# EAGLE design Scanit (EAGLE 7.2.0)

## Sheet 1 of 4
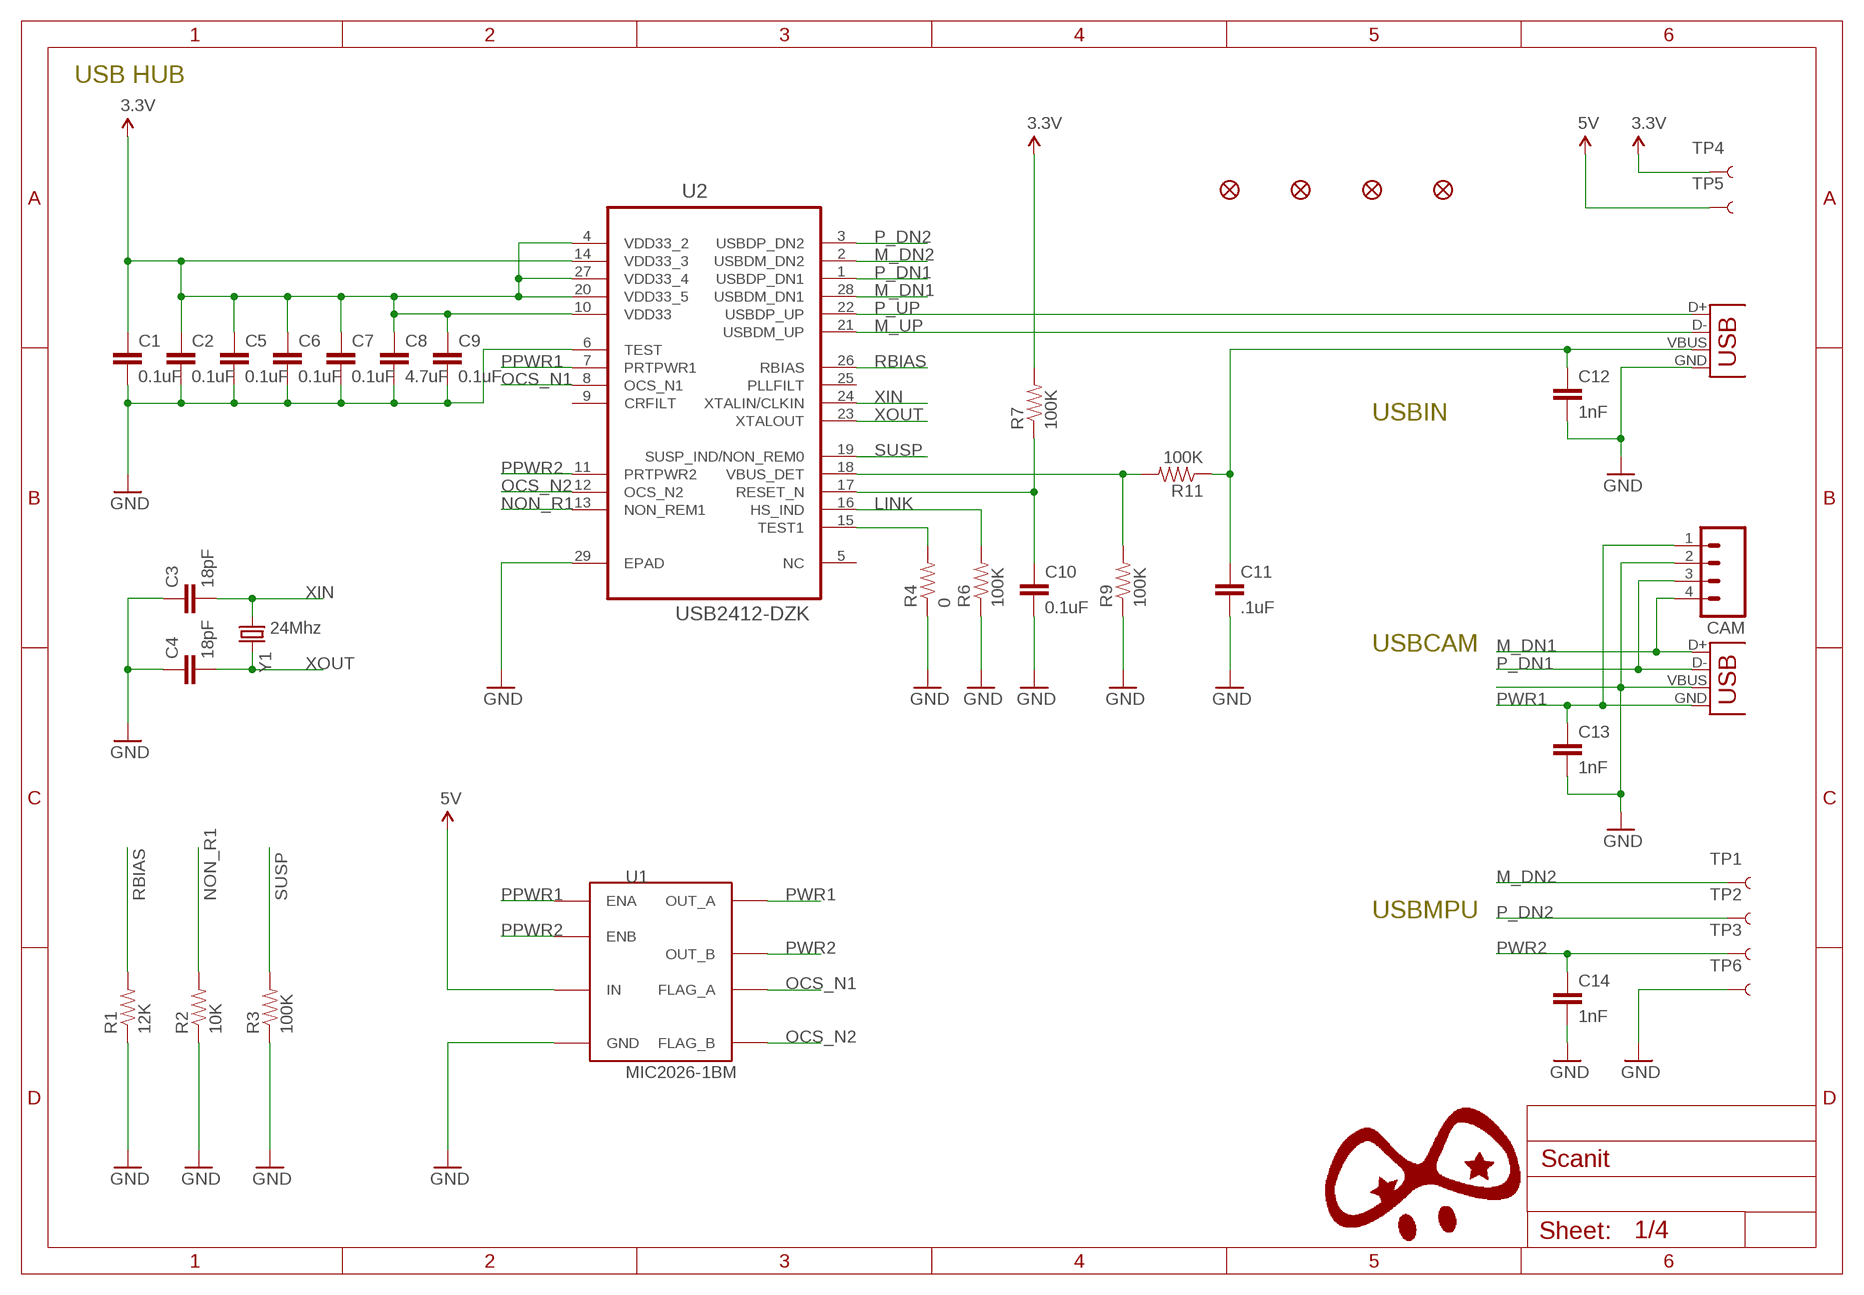
[diagram p0: schematic, sheet 1]

### Parts
C1  0.1uF  CAP0603-CAP  [0603-CAP]
C2  0.1uF  CAP0603-CAP  [0603-CAP]
C3  18pF  CAP0603-CAP  [0603-CAP]
C4  18pF  CAP0603-CAP  [0603-CAP]
C5  0.1uF  CAP0603-CAP  [0603-CAP]
C6  0.1uF  CAP0603-CAP  [0603-CAP]
C7  0.1uF  CAP0603-CAP  [0603-CAP]
C8  4.7uF  CAP0603-CAP  [0603-CAP]
C9  0.1uF  CAP0603-CAP  [0603-CAP]
C10  0.1uF  CAP0603-CAP  [0603-CAP]
C11  .1uF  CAP0603-CAP  [0603-CAP]
C12  1nF  CAP0603-CAP  [0603-CAP]
C13  1nF  CAP0603-CAP  [0603-CAP]
C14  1nF  CAP0603-CAP  [0603-CAP]
CAM  M04JST-PTH-VERT  [JST-4-PTH-VERT]
FID1  FIDUCIAL1X2  [FIDUCIAL-1X2]
FID2  FIDUCIAL1X2  [FIDUCIAL-1X2]
FID3  FIDUCIAL1X2  [FIDUCIAL-1X2]
FID4  FIDUCIAL1X2  [FIDUCIAL-1X2]
R1  12K  RESISTOR0603  [0603-RES]
R2  10K  RESISTOR0603  [0603-RES]
R3  100K  RESISTOR0603  [0603-RES]
R4  0  RESISTOR0603  [0603-RES]
R6  100K  RESISTOR0603  [0603-RES]
R7  100K  RESISTOR0603  [0603-RES]
R9  100K  RESISTOR0603  [0603-RES]
R11  100K  RESISTOR0603  [0603-RES]
TP1  TEST-POINT3X5  [PAD.03X.05]
TP2  TEST-POINT3X5  [PAD.03X.05]
TP3  TEST-POINT3X5  [PAD.03X.05]
TP4  TEST-POINT3X5  [PAD.03X.05]
TP5  TEST-POINT3X5  [PAD.03X.05]
TP6  TEST-POINT3X5  [PAD.03X.05]
U1  MIC2026-1BM  MIC2026  [SOP-8]
U2  USB2412-DZK  [QFN50P500X500X100-29N]
USB  USBPTH-VERTICAL  [USB-B-PTH-VERTICAL]
USBCAM  USB-A-S  [USB-A-S]
Y1  24Mhz  CRYSTAL5X3  [CRYSTAL-SMD-5X3]

### Nets
3.3V: C1.1 C2.1 C5.1 C6.1 C7.1 C8.1 C9.1 R7.2 TP4.P$1 U2.4(VDD33_2) U2.10(VDD33) U2.14(VDD33_3) U2.20(VDD33_5) U2.27(VDD33_4) ; also sheet 2,3,4
5V: TP5.P$1 U1.7(IN) ; also sheet 2,4
GND: C1.2 C2.2 C3.1 C4.1 C5.2 C6.2 C7.2 C8.2 C9.2 C10.2 C11.2 C12.2 C13.2 C14.2 CAM.2 R1.1 R2.1 R3.1 R4.1 R6.1 R9.1 TP6.P$1 U1.6(GND) U2.6(TEST) U2.29(EPAD) USB.GND USBCAM.VBUS ; also sheet 2,3,4
LINK: R6.2 U2.16(HS_IND)
M_DN1: CAM.4 U2.28(USBDM_DN1) USBCAM.D+
M_DN2: TP1.P$1 U2.2(USBDM_DN2) ; also sheet 2
M_UP: U2.21(USBDM_UP) USB.D-
N$1: R4.2 U2.15(TEST1)
N$2: C10.1 R7.1 U2.17(RESET_N)
N$7: R9.2 R11.2 U2.18(VBUS_DET)
N$8: C11.1 C12.1 R11.1 USB.VBUS
NON_R1: R2.2 U2.13(NON_REM1)
OCS_N1: U1.2(FLAG_A) U2.8(OCS_N1)
OCS_N2: U1.3(FLAG_B) U2.12(OCS_N2)
P_DN1: CAM.3 U2.1(USBDP_DN1) USBCAM.D-
P_DN2: TP2.P$1 U2.3(USBDP_DN2) ; also sheet 2
P_UP: U2.22(USBDP_UP) USB.D+
PPWR1: U1.1(ENA) U2.7(PRTPWR1)
PPWR2: U1.4(ENB) U2.11(PRTPWR2)
PWR1: C13.1 CAM.1 U1.8(OUT_A) USBCAM.GND
PWR2: C14.1 TP3.P$1 U1.5(OUT_B) ; also sheet 2
RBIAS: R1.2 U2.26(RBIAS)
SUSP: R3.2 U2.19(SUSP_IND/NON_REM0)
XIN: C3.2 U2.24(XTALIN/CLKIN) Y1.1
XOUT: C4.2 U2.23(XTALOUT) Y1.3
Unconnected: U2.5(NC) U2.9(CRFILT) U2.25(PLLFILT)

### Notes on the sheet
- USB HUB
- USBIN
- USBCAM
- USBMPU

## Sheet 2 of 4
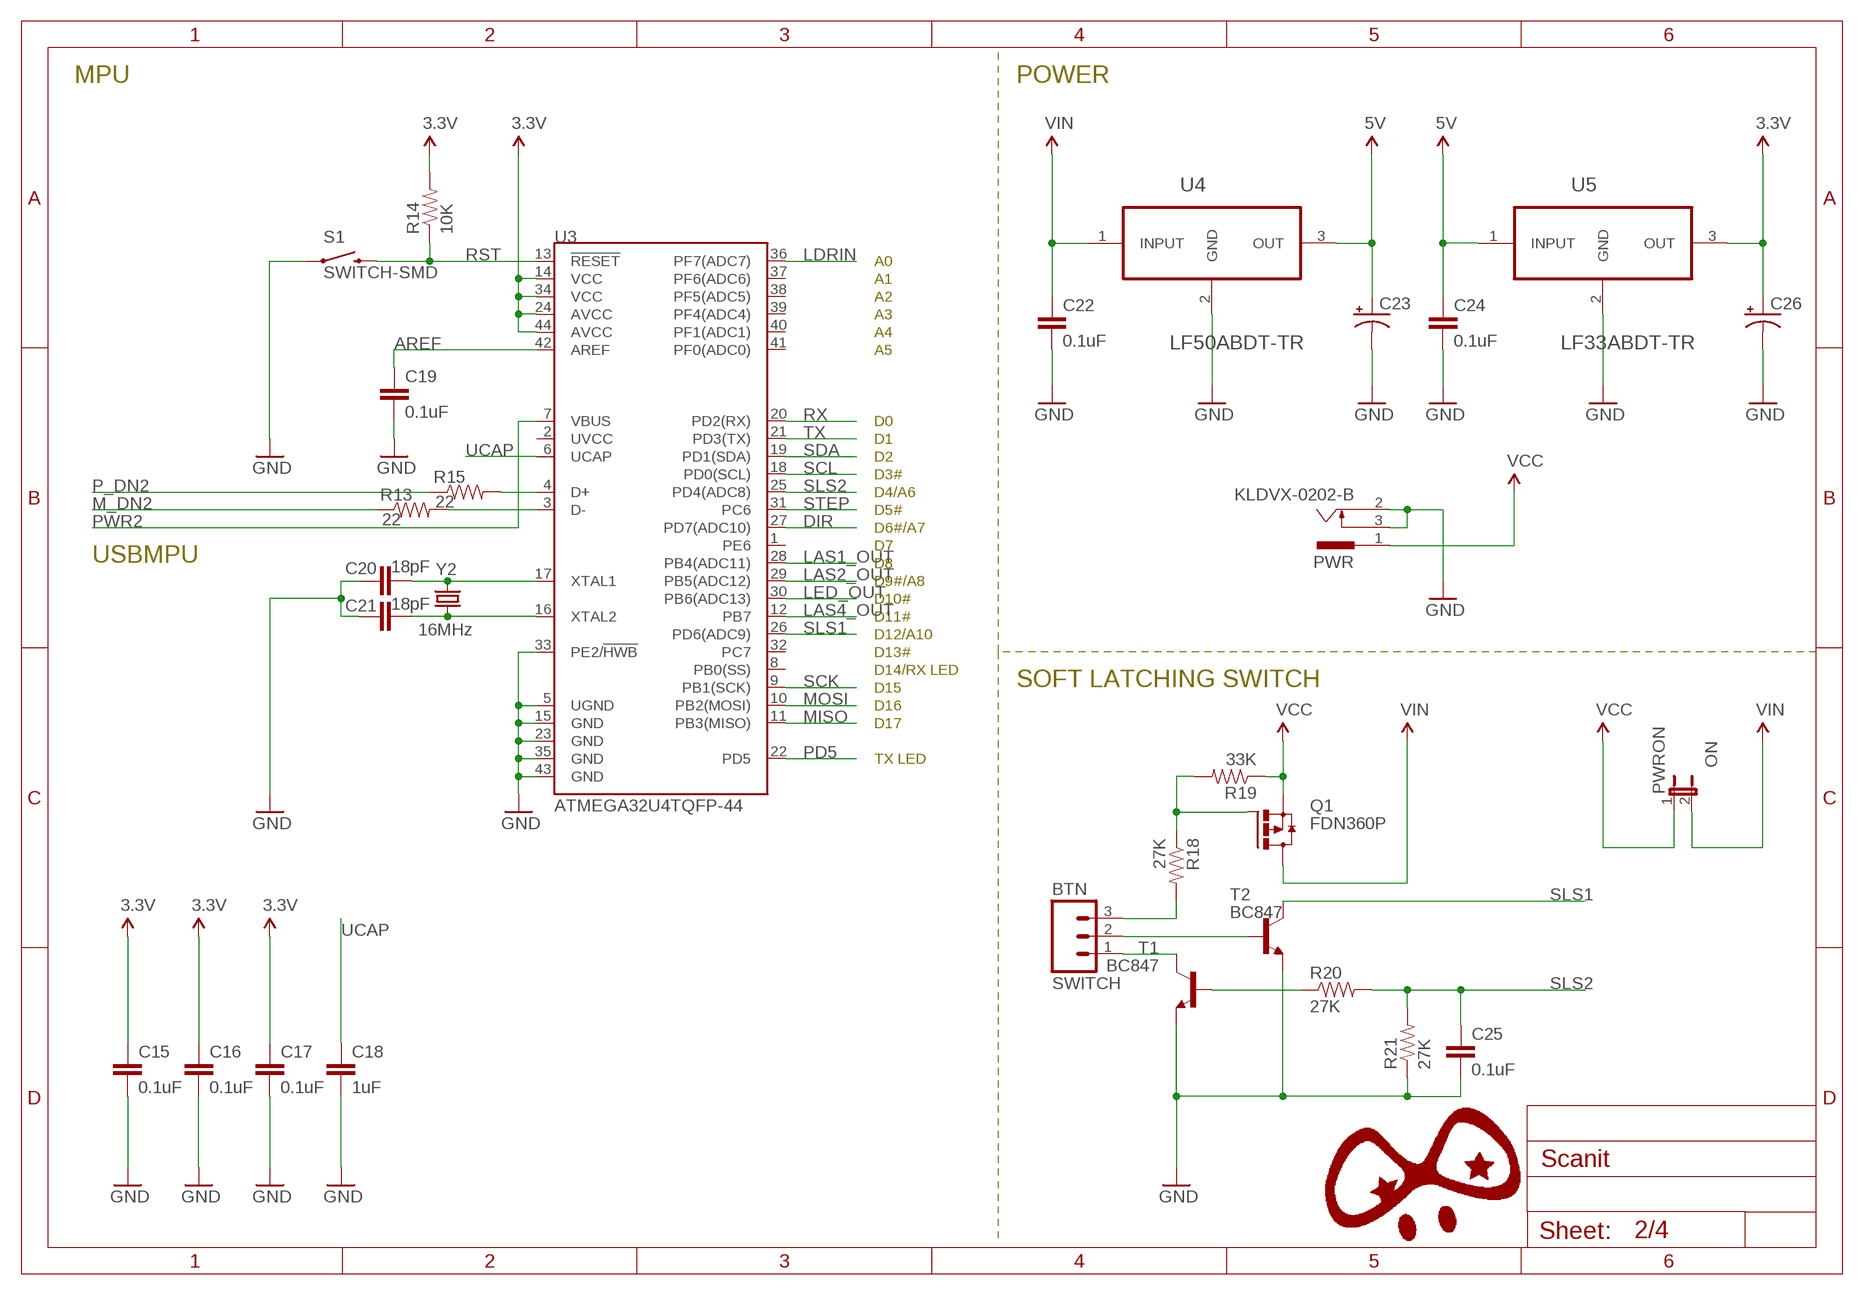
[diagram p1: schematic, sheet 2]

### Parts
BTN  SWITCH  M03JST-PTH-VERT  [JST-3-PTH-VERT]
C15  0.1uF  CAP0603-CAP  [0603-CAP]
C16  0.1uF  CAP0603-CAP  [0603-CAP]
C17  0.1uF  CAP0603-CAP  [0603-CAP]
C18  1uF  CAP0603-CAP  [0603-CAP]
C19  0.1uF  CAP0603-CAP  [0603-CAP]
C20  18pF  CAP0603-CAP  [0603-CAP]
C21  18pF  CAP0603-CAP  [0603-CAP]
C22  0.1uF  CAP1210  [1210]
C23  CAP_POLD  [PANASONIC_D]
C24  0.1uF  CAP1210  [1210]
C25  0.1uF  CAP0603-CAP  [0603-CAP]
C26  CAP_POLD  [PANASONIC_D]
PWR  KLDVX-0202-B  [KLDVX-0202-B]
PWRON  ON  JUMPER-2PTH  [1X02]
Q1  FDN360P  [SUPER-SOT3]
R13  22  RESISTOR0402-RES  [0402-RES]
R14  10K  RESISTOR0603-RES  [0603-RES]
R15  22  RESISTOR0402-RES  [0402-RES]
R18  27K  RESISTOR0603-RES  [0603-RES]
R19  33K  RESISTOR0603-RES  [0603-RES]
R20  27K  RESISTOR0603-RES  [0603-RES]
R21  27K  RESISTOR0603-RES  [0603-RES]
S1  SWITCH-SMD  SWITCH-MOMENTARY-2SMD  [TACTILE_SWITCH_SMD]
T1  BC847  [SOT23]
T2  BC847  [SOT23]
U3  ATMEGA32U4TQFP-44  [TQFP44]
U4  LF50ABDT-TR  LF33ABDT-TR  [TO228P972X240-3N]
U5  LF33ABDT-TR  [TO228P972X240-3N]
Y2  16MHz  CRYSTAL5X3  [CRYSTAL-SMD-5X3]

### Nets
3.3V: C15.1 C16.1 C17.1 C26.+ R14.2 U3.14(VCC) U3.24(AVCC) U3.34(VCC) U3.44(AVCC) U5.3(OUT) ; also sheet 1,3,4
5V: C23.+ C24.1 U4.3(OUT) U5.1(INPUT) ; also sheet 1,4
AREF: C19.1 U3.42(AREF)
DIR: U3.27(PD7(ADC10)) ; also sheet 3
GND: C15.2 C16.2 C17.2 C18.2 C19.2 C20.1 C21.1 C22.2 C23.- C24.2 C25.2 C26.- PWR.2 PWR.3 R21.1 S1.1 T1.2(E) T2.2(E) U3.5(UGND) U3.15(GND) U3.23(GND) U3.33(PE2/!HWB) U3.35(GND) U3.43(GND) U4.2(GND) U5.2(GND) ; also sheet 1,3,4
LAS1_OUT: U3.28(PB4(ADC11)) ; also sheet 4
LAS2_OUT: U3.29(PB5(ADC12)) ; also sheet 4
LAS4_OUT: U3.12(PB7)
LDRIN: U3.36(PF7(ADC7)) ; also sheet 3
LED_OUT: U3.30(PB6(ADC13)) ; also sheet 3
M_DN2: R13.1 ; also sheet 1
MISO: U3.11(PB3(MISO)) ; also sheet 4
MOSI: U3.10(PB2(MOSI)) ; also sheet 4
N$9: C20.2 U3.17(XTAL1) Y2.3
N$10: C21.2 U3.16(XTAL2) Y2.1
N$11: R15.2 U3.4(D+)
N$12: R13.2 U3.3(D-)
N$13: BTN.1 T1.3(C)
N$42: Q1.1(G) R18.1 R19.2
N$43: BTN.3 R18.2
N$45: BTN.2 T2.1(B)
N$46: R20.1 T1.1(B)
P_DN2: R15.1 ; also sheet 1
PD5: U3.22(PD5)
PWR2: U3.7(VBUS) ; also sheet 1
RST: R14.1 S1.3 U3.13(!RESET) ; also sheet 4
RX: U3.20(PD2(RX))
SCK: U3.9(PB1(SCK)) ; also sheet 4
SCL: U3.18(PD0(SCL))
SDA: U3.19(PD1(SDA))
SLS1: T2.3(C) U3.26(PD6(ADC9))
SLS2: C25.1 R20.2 R21.2 U3.25(PD4(ADC8))
STEP: U3.31(PC6) ; also sheet 3
TX: U3.21(PD3(TX))
UCAP: C18.1 U3.6(UCAP)
VCC: PWR.1 PWRON.1 Q1.2(S) R19.1
VIN: C22.1 PWRON.2 Q1.3(D) U4.1(INPUT) ; also sheet 3
Unconnected: PWR.1@1 PWR.2@1 PWR.3@1 U3.1(PE6) U3.2(UVCC) U3.8(PB0(SS)) U3.32(PC7) U3.37(PF6(ADC6)) U3.38(PF5(ADC5)) U3.39(PF4(ADC4)) U3.40(PF1(ADC1)) U3.41(PF0(ADC0))

### Notes on the sheet
- MPU | POWER
- USBMPU
- SOFT LATCHING SWITCH

## Sheet 3 of 4
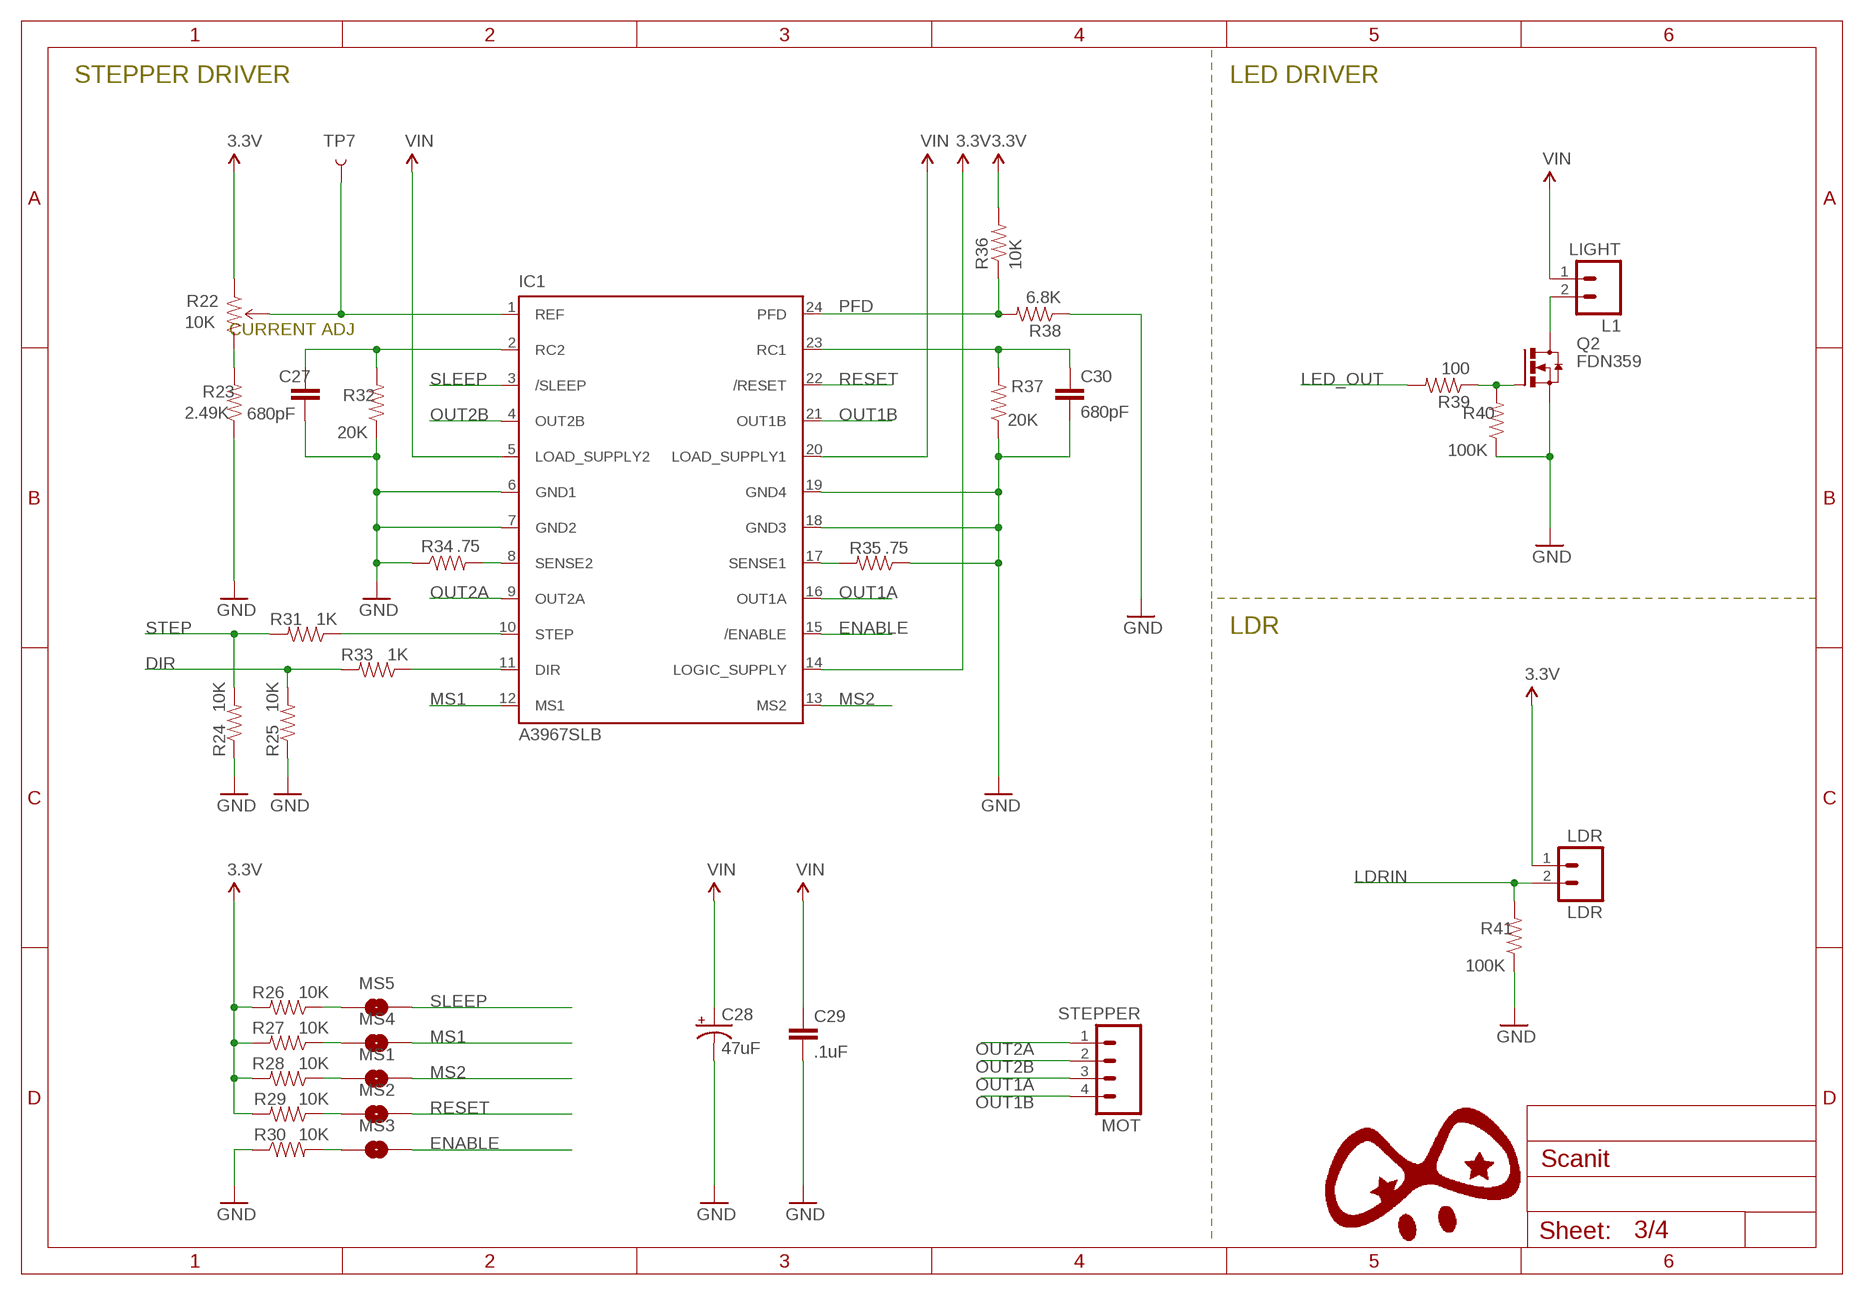
[diagram p2: schematic, sheet 3]

### Parts
C27  680pF  CAP0603-CAP  [0603-CAP]
C28  47uF  CPOL-USD  [PANASONIC_D]
C29  .1uF  CAP0603-CAP  [0603-CAP]
C30  680pF  CAP0603-CAP  [0603-CAP]
IC1  A3967SLB  [SO24W]
L1  LIGHT  M02JST-PTH-VERT  [JST-2-PTH-VERT]
LDR  LDR  M02JST-PTH-VERT  [JST-2-PTH-VERT]
MOT  STEPPER  M04JST-PTH-VERT  [JST-4-PTH-VERT]
MS1  SOLDERJUMPERTRACE  [SJ_2S-TRACE]
MS2  SOLDERJUMPERTRACE  [SJ_2S-TRACE]
MS3  SOLDERJUMPERTRACE  [SJ_2S-TRACE]
MS4  SOLDERJUMPERTRACE  [SJ_2S-TRACE]
MS5  SOLDERJUMPERTRACE  [SJ_2S-TRACE]
Q2  FDN359  [SUPER-SOT3]
R22  10K  TRIMPOT3MM-2  [TRIMPOT-3MM-2]
R23  2.49K  RESISTOR0603  [0603-RES]
R24  10K  RESISTOR0603  [0603-RES]
R25  10K  RESISTOR0603  [0603-RES]
R26  10K  RESISTOR0603  [0603-RES]
R27  10K  RESISTOR0603  [0603-RES]
R28  10K  RESISTOR0603  [0603-RES]
R29  10K  RESISTOR0603  [0603-RES]
R30  10K  RESISTOR0603  [0603-RES]
R31  1K  RESISTOR0603  [0603-RES]
R32  20K  RESISTOR0603  [0603-RES]
R33  1K  RESISTOR0603  [0603-RES]
R34  .75  RESISTOR0805-RES  [0805]
R35  .75  RESISTOR0805-RES  [0805]
R36  10K  RESISTOR0603  [0603-RES]
R37  20K  RESISTOR0603  [0603-RES]
R38  6.8K  RESISTOR0603  [0603-RES]
R39  100  RESISTOR0603  [0603-RES]
R40  100K  RESISTOR0603  [0603-RES]
R41  100K  RESISTOR0603  [0603-RES]
TP7  TEST-POINTTP_15TH_THRU  [TP_15TH]

### Nets
3.3V: IC1.14(LOGIC_SUPPLY) LDR.1 R22.1(CCW) R26.2 R27.2 R28.2 R29.2 R36.2 ; also sheet 1,2,4
DIR: R25.2 R33.2 ; also sheet 2
ENABLE: IC1.15(/ENABLE) MS3.2
GND: C27.2 C28.- C29.2 C30.2 IC1.6(GND1) IC1.7(GND2) IC1.18(GND3) IC1.19(GND4) Q2.2(S) R23.1 R24.1 R25.1 R30.1 R32.1 R34.1 R35.1 R37.1 R38.1 R40.1 R41.1 ; also sheet 1,2,4
LDRIN: LDR.2 R41.2 ; also sheet 2
LED_OUT: R39.2 ; also sheet 2
MS1: IC1.12(MS1) MS4.2
MS2: IC1.13(MS2) MS1.2
N$14: IC1.8(SENSE2) R34.2
N$15: IC1.17(SENSE1) R35.2
N$16: C27.1 IC1.2(RC2) R32.2
N$17: C30.1 IC1.23(RC1) R37.2
N$18: R22.3(CW) R23.2
N$19: IC1.10(STEP) R31.1
N$20: IC1.11(DIR) R33.1
N$21: MS5.1 R26.1
N$23: MS4.1 R27.1
N$24: MS1.1 R28.1
N$25: MS2.1 R29.1
N$26: MS3.1 R30.2
N$27: Q2.1(G) R39.1 R40.2
N$28: L1.2 Q2.3(D)
N$33: L1.1
OUT1A: IC1.16(OUT1A) MOT.3
OUT1B: IC1.21(OUT1B) MOT.4
OUT2A: IC1.9(OUT2A) MOT.1
OUT2B: IC1.4(OUT2B) MOT.2
PFD: IC1.24(PFD) R36.1 R38.2
RESET: IC1.22(/RESET) MS2.2
SLEEP: IC1.3(/SLEEP) MS5.2
STEP: R24.2 R31.2 ; also sheet 2
VIN: C28.+ C29.1 IC1.5(LOAD_SUPPLY2) IC1.20(LOAD_SUPPLY1) ; also sheet 2
VREF: IC1.1(REF) R22.2(WIPER) TP7.P$1

### Notes on the sheet
- STEPPER DRIVER | LED DRIVER
- CURRENT ADJ
- LDR

## Sheet 4 of 4
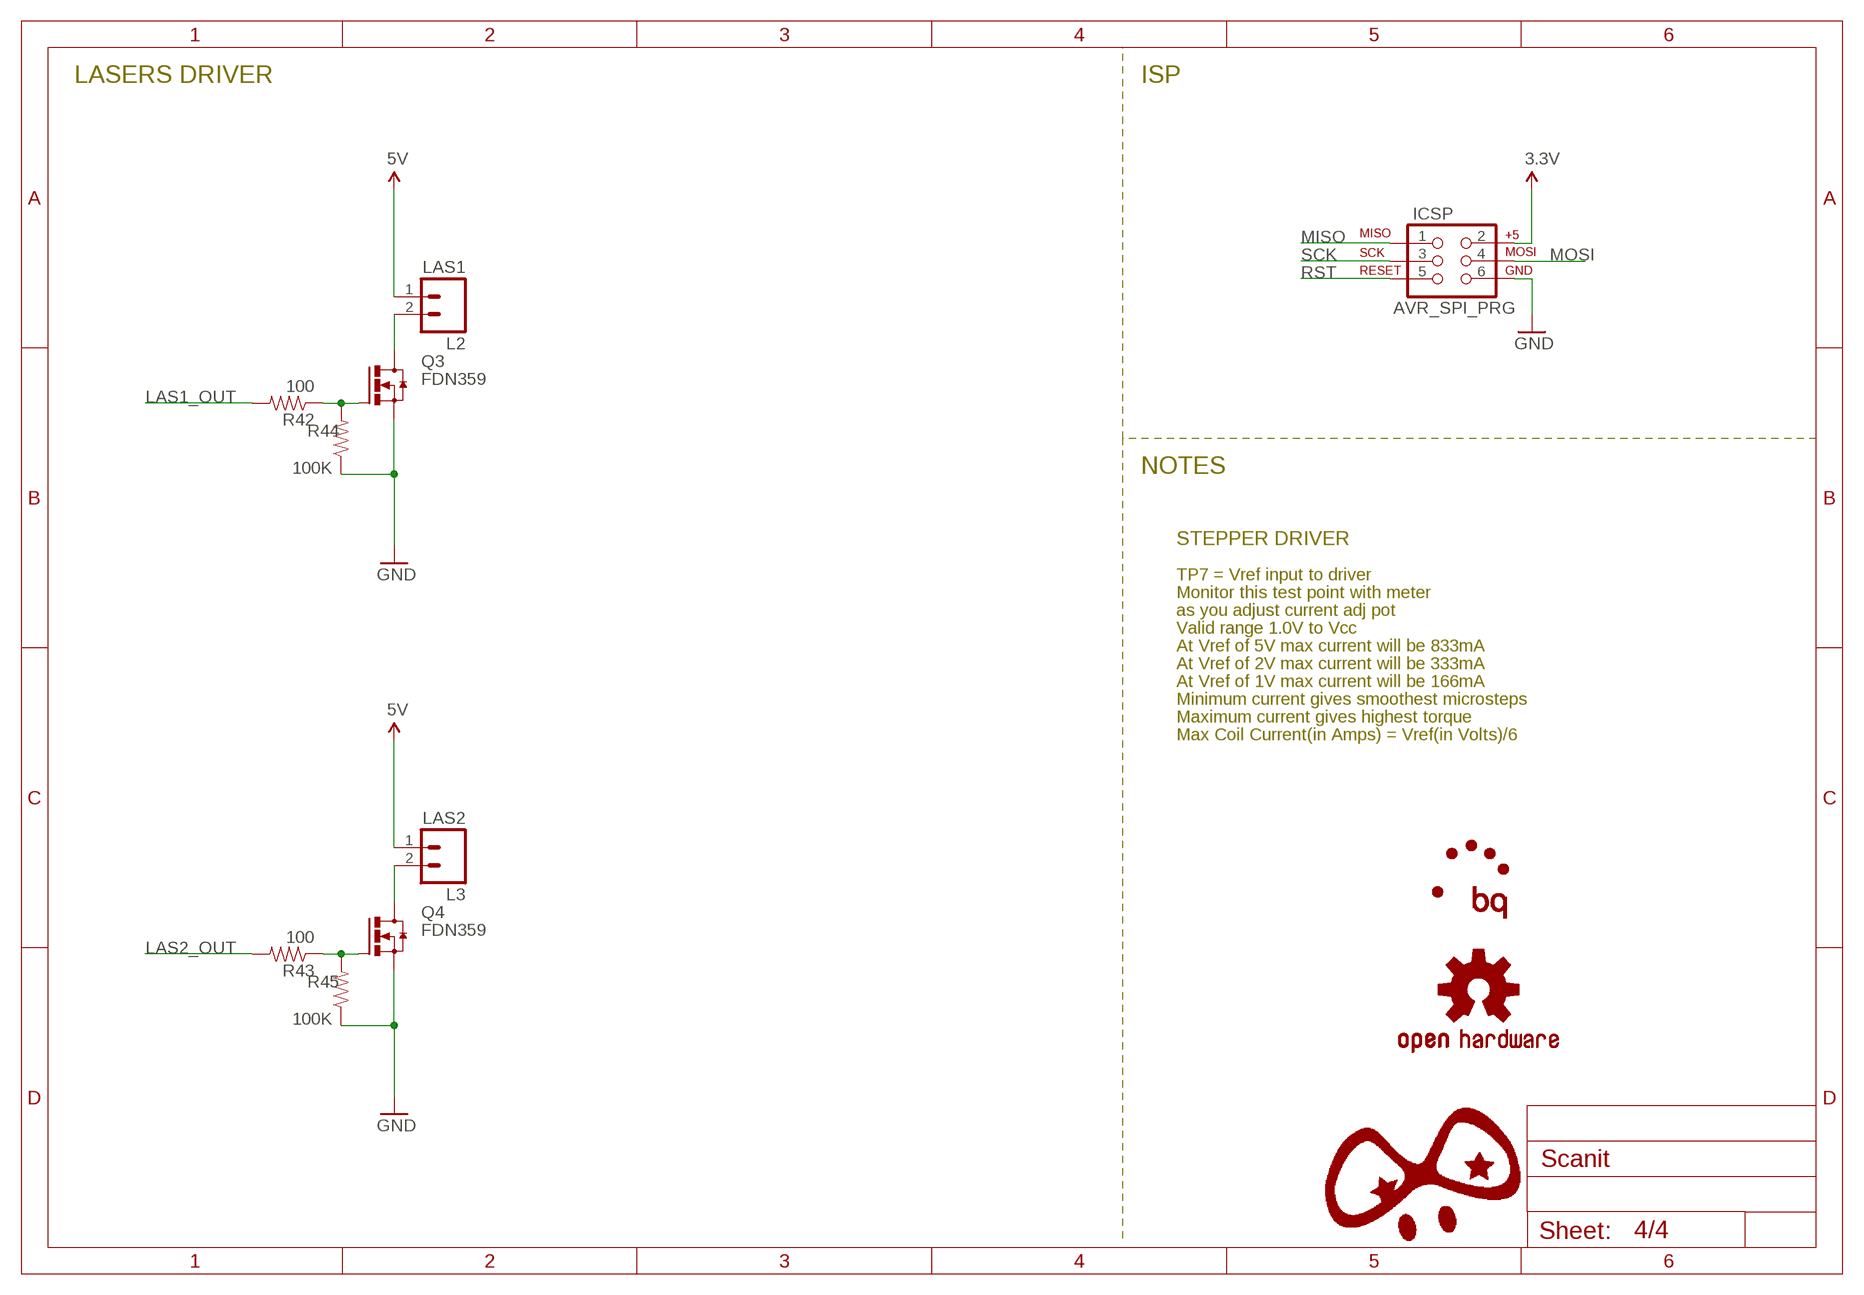
[diagram p3: schematic, sheet 4]

### Parts
ICSP  AVR_SPI_PRG  AVR_SPI_PRG_6PTH  [2X3]
L2  LAS1  M02JST-PTH-VERT  [JST-2-PTH-VERT]
L3  LAS2  M02JST-PTH-VERT  [JST-2-PTH-VERT]
LOGO2  OSHW-LOGOM  [OSHW-LOGO-M]
Q3  FDN359  [SUPER-SOT3]
Q4  FDN359  [SUPER-SOT3]
R42  100  RESISTOR0603  [0603-RES]
R43  100  RESISTOR0603  [0603-RES]
R44  100K  RESISTOR0603  [0603-RES]
R45  100K  RESISTOR0603  [0603-RES]

### Nets
3.3V: ICSP.2 ; also sheet 1,2,3
5V: L2.1 L3.1 ; also sheet 1,2
GND: ICSP.6 Q3.2(S) Q4.2(S) R44.1 R45.1 ; also sheet 1,2,3
LAS1_OUT: R42.2 ; also sheet 2
LAS2_OUT: R43.2 ; also sheet 2
MISO: ICSP.1 ; also sheet 2
MOSI: ICSP.4 ; also sheet 2
N$29: Q3.1(G) R42.1 R44.2
N$30: L2.2 Q3.3(D)
N$31: Q4.1(G) R43.1 R45.2
N$32: L3.2 Q4.3(D)
RST: ICSP.5 ; also sheet 2
SCK: ICSP.3 ; also sheet 2

### Notes on the sheet
- LASERS DRIVER | ISP
- NOTES
- STEPPER DRIVER
- TP7 = Vref input to driver
- Monitor this test point with meter
- as you adjust current adj pot
- Valid range 1.0V to Vcc
- At Vref of 5V max current will be 833mA
- At Vref of 2V max current will be 333mA
- At Vref of 1V max current will be 166mA
- Minimum current gives smoothest microsteps
- Maximum current gives highest torque
- Max Coil Current(in Amps) = Vref(in Volts)/6

## Library data of the parts
BTN = SparkFun-Connectors:M03: Header 3 Standard 3-pin 0.1" header. Use with straight break away headers (SKU : PRT-00116), right angle break away headers (PRT-00553), swiss pins (PRT-00743), machine pins (PRT-00117), and female headers (PRT-00115). Molex polarized connector foot print use with SKU : PRT-08232 with associated crimp pins and housings.
C1-C14 C22 C24 C27 C29 C30 = SparkFun-Capacitors:CAP: Capacitor Standard 0603 ceramic capacitor, and 0.1" leaded capacitor.
C15-C21 C25 = SparkFun:CAP: Capacitor Standard 0603 ceramic capacitor, and 0.1" leaded capacitor.
C23 C26 = SparkFun-Capacitors:CAP_POL: Capacitor Polarized These are standard SMD and PTH capacitors. Normally 10uF, 47uF, and 100uF in electrolytic and tantalum varieties. Always verify the external diameter of the through hole cap, it varies with capacity, voltage, and manufacturer. The EIA devices should be standard.
C28 = rcl:CPOL-US: POLARIZED CAPACITOR, American symbol
CAM MOT = SparkFun-Connectors:M04: Header 4 Standard 4-pin 0.1" header. Use with straight break away headers (SKU : PRT-00116), right angle break away headers (PRT-00553), swiss pins (PRT-00743), machine pins (PRT-00117), and female headers (PRT-00115). Molex polarized connector foot print use with SKU : PRT-08231 with associated crimp pins and housings. 1MM SMD Version SKU: PRT-10208
FID1-FID4 = SparkFun-Aesthetics:FIDUCIAL: Fiducial Alignment Points Various fiducial points for machine vision alignment.
IC1 = Allegro:A3967SLB: ANALOG DEVICES
ICSP = SparkFun:AVR_SPI_PRG_6: AVR ISP 6 Pin This is the reduced ISP connector for AVR programming. Common on Arduino. This footprint will take up less PCB space and can be used with a 10-pin to 6-pin adapter such as SKU: BOB-08508
L1-L3 LDR = SparkFun-Connectors:M02: Standard 2-pin 0.1" header. Use with - straight break away headers ( PRT-00116) - right angle break away headers (PRT-00553) - swiss pins (PRT-00743) - machine pins (PRT-00117) - female headers (PRT-00115) Molex polarized connector foot print use with: PRT-08233 with associated crimp pins and housings. 2.54_SCREWTERM for use with PRT-10571. 3.5mm Screw Terminal footprints for PRT-08084 5mm Screw Terminal footprints for use with PRT-08432
LOGO2 = SparkFun-Aesthetics:OSHW-LOGO: Open Source Hardware Logo This logo indicates the piece of hardware it is found on incorporates a OSHW license and/or adheres to the definition of open source hardware found here: http://freedomdefined.org/OSHW
MS1-MS5 = SparkFun-Retired:SOLDERJUMPER: Solder Jumper Standard SMD solder jumper. Used to automate production. Two varients : Normally Open and Normally Closed are the same, but have different paste layers. NC will have a large amount of paste and should jumper during reflow.
PWR = con-kycon:KLDVX-0202-: Power Jack, Vertical, PCB Mount, 2.0 mm, 2.5 mm, 3.0 mm Center Pin Source: KLDVX-0202x.pdf; OC_FARNELL: unknown; OC_NEWARK: unknown
PWRON = SparkFun-Retired:JUMPER-2: Jumper Basic 0.1" spaced jumper. Use with breakaway headers.
Q1 = transistor-power:FDN360P: Single P-Channel, PowerTrench (R) MOSFET Source: http://www.fairchildsemi.com/ds/FD/FDN360P.pdf
Q2-Q4 = transistor-power:FDN359
R1-R4 R6 R7 R9 R11 R23-R45 = SparkFun-Resistors:RESISTOR: Resistor Basic schematic elements and footprints for 0603, 1206, and PTH resistors.
R13-R15 R18-R21 = SparkFun:RESISTOR: Resistor Basic schematic elements and footprints for 0603, 1206, and PTH resistors.
R22 = SparkFun-Electromechanical:TRIMPOT: Various small potentiometers for "set-and-forget" applications
S1 = SparkFun:SWITCH-MOMENTARY-2
T1 T2 = transistor:BC847: NPN TRANSISTOR
TP1-TP7 = SparkFun-Passives:TEST-POINT: Bare copper test points for troubleshooting or ICT
U1 = mic2026:MIC2026: Digikey No:- __576-2137-ND__
U2 = usb2412:USB2412-DZK: IC, 2-PORT USB 2.0 HUB CNTRL, 28VQFN; MPN: USB2412-DZK; OC_FARNELL: 2292600; OC_NEWARK: 66W2133; PACKAGE: 28VQFN; SUPPLIER: Microchip
U3 = SparkFun-DigitalIC:ATMEGA32U4: Atmel 44-pin 8-bit Microcontroller with 32KBytes of ISP Flash and USB Controller
U4 U5 = STM-LF33ABDT-TR:LF33ABDT-TR: LDO, 0.45VDO, 1A, 3.3V, 1%, 3TO252; MPN: LF33ABDT-TR; OC_FARNELL: 2253503; OC_NEWARK: 26M0226; PACKAGE: DPAK; SUPPLIER: STMicroelectronics
USB USBCAM = SparkFun-Connectors:USB: USB Connectors USB-B-PTH is fully proven SKU : PRT-00139/CONN-08278 USB-miniB is fully proven SKU : PRT-00587 USB-A-PCB is untested. USB-A-H is throughly reviewed, but untested. Spark Fun Electronics SKU : PRT-00437 USB-B-SMT is throughly reviewed, but untested. Needs silkscreen touching up. USB-A-S has not been used/tested USB-MB-H has not been used/tested USB-MICROB has been used. CONN-09505
Y1 = SparkFun-FreqCtrl:CRYSTAL: Various standard crystals. Proven footprints.; PROD_ID: XTAL-08218
Y2 = SparkFun:CRYSTAL: Crystals Various standard crystals. Proven footprints. Spark Fun Electronics SKU : COM-00534

## Board
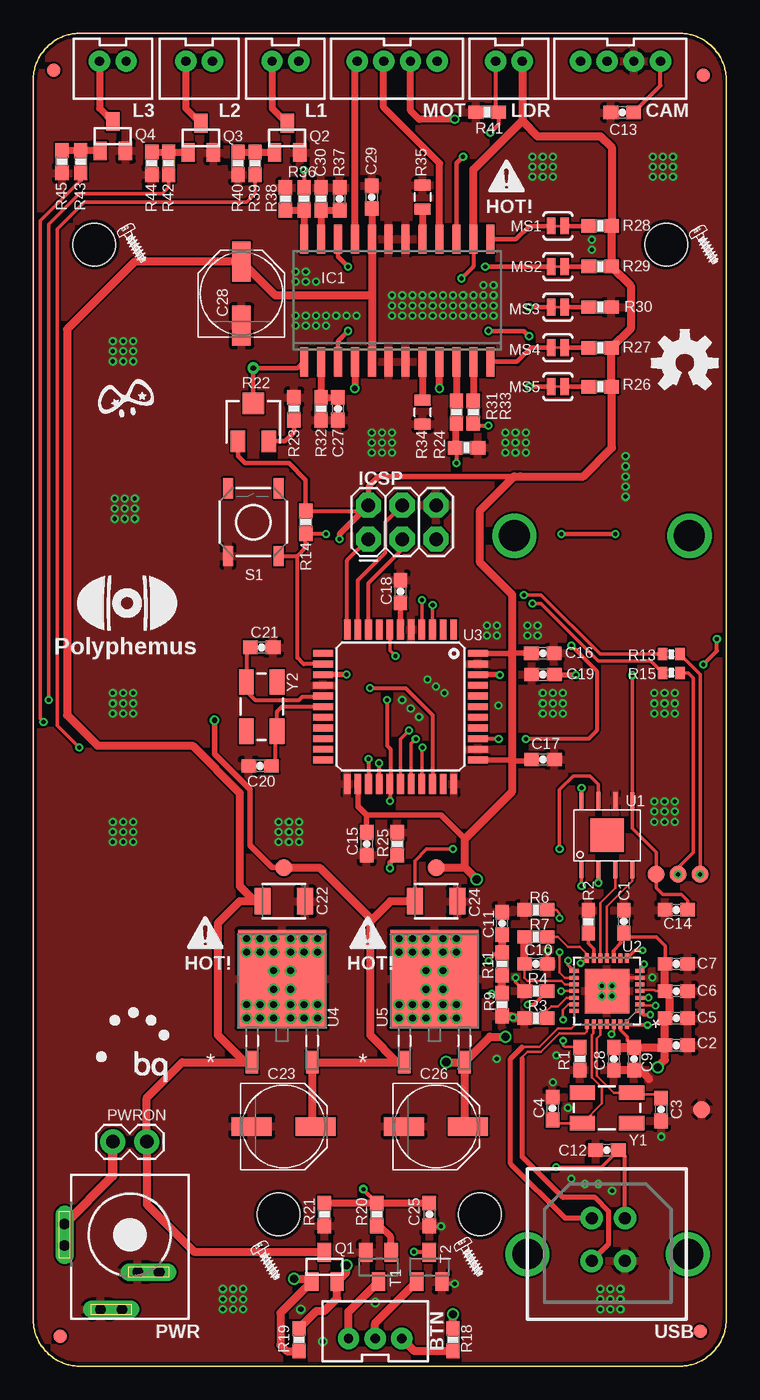
[diagram p4: board, top side]
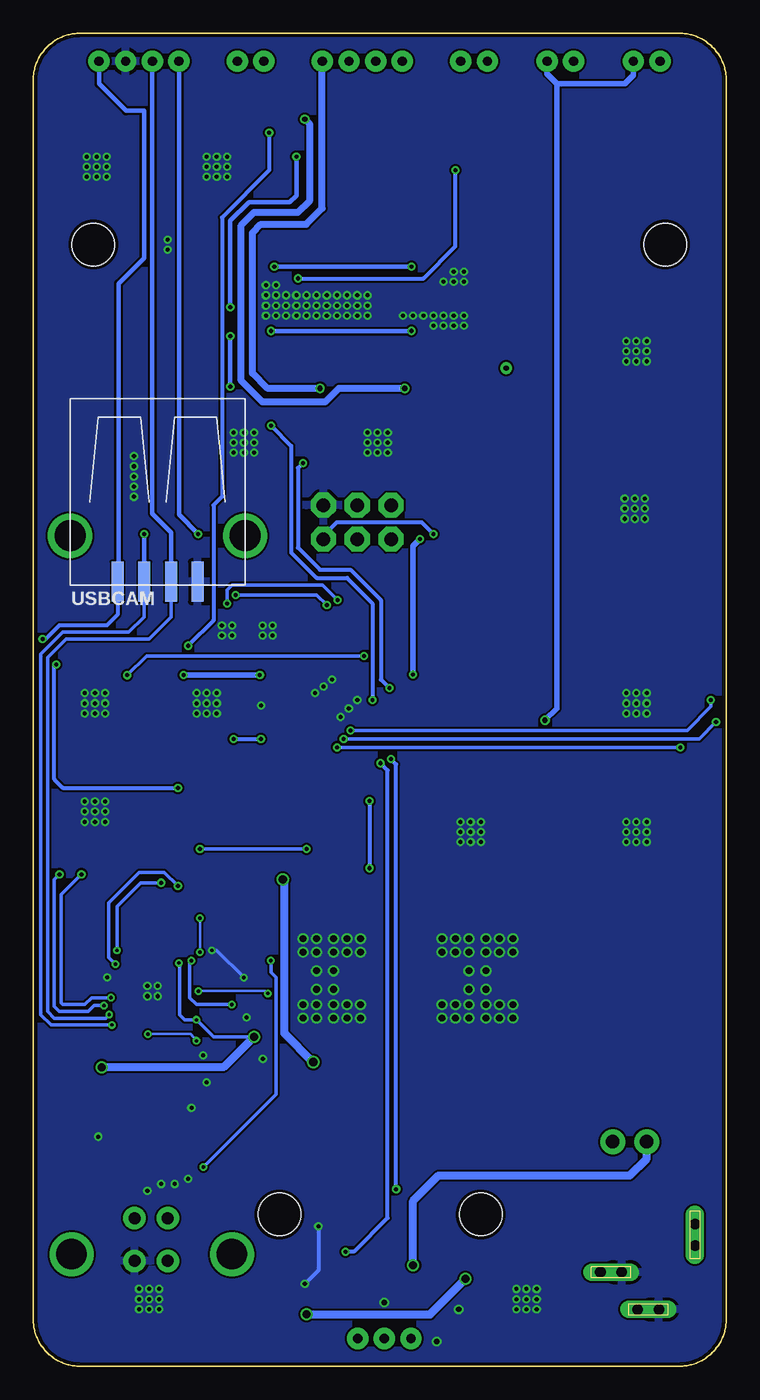
[diagram p5: board, bottom side, seen from below]

Size 52 x 100 mm. Coordinates in mm from the lower left corner, seen from the top.
Outline: 52,3.38 51.99,3.26 51.98,3.14 51.97,3.03 51.95,2.91 51.93,2.8 51.9,2.68 51.88,2.57 51.84,2.46 51.81,2.35 51.77,2.25 51.72,2.14 51.68,2.04 51.63,1.93 51.58,1.84 51.52,1.74 51.46,1.64 51.4,1.55 51.34,1.45 51.27,1.36 51.2,1.28 51.13,1.19 51.05,1.11 50.89,0.95 50.81,0.87 50.72,0.8 50.64,0.73 50.55,0.66 50.45,0.6 50.36,0.54 50.26,0.48 50.16,0.42 50.07,0.37 49.96,0.32 49.86,0.28 49.75,0.23 49.65,0.19 49.54,0.16 49.43,0.12 49.32,0.1 49.09,0.05 48.97,0.03 48.86,0.02 48.74,0.01 48.62,0 3.38,0 3.26,0.01 3.14,0.02 3.03,0.03 2.91,0.05 2.68,0.1 2.57,0.12 2.46,0.16 2.35,0.19 2.25,0.23 2.14,0.28 2.04,0.32 1.93,0.37 1.84,0.42 1.74,0.48 1.64,0.54 1.55,0.6 1.45,0.66 1.36,0.73 1.28,0.8 1.19,0.87 1.11,0.95 1.03,1.03 0.95,1.11 0.87,1.19 0.8,1.28 0.73,1.36 0.66,1.45 0.6,1.55 0.54,1.64 0.48,1.74 0.42,1.84 0.37,1.93 0.32,2.04 0.28,2.14 0.23,2.25 0.19,2.35 0.12,2.57 0.09,2.68 0.07,2.8 0.05,2.91 0.03,3.03 0.02,3.14 0.01,3.26 0,3.38 0,96.62 0.01,96.74 0.03,96.97 0.05,97.09 0.07,97.2 0.09,97.32 0.12,97.43 0.16,97.54 0.19,97.65 0.23,97.75 0.28,97.86 0.32,97.96 0.37,98.07 0.42,98.17 0.48,98.26 0.54,98.36 0.6,98.45 0.66,98.55 0.73,98.64 0.8,98.72 0.87,98.81 0.95,98.89 1.03,98.97 1.11,99.05 1.19,99.13 1.28,99.2 1.36,99.27 1.45,99.34 1.55,99.4 1.64,99.46 1.74,99.52 1.84,99.58 1.93,99.63 2.04,99.68 2.14,99.72 2.25,99.77 2.35,99.81 2.46,99.84 2.57,99.88 2.68,99.91 2.91,99.95 3.03,99.97 3.14,99.98 3.26,99.99 3.38,100 48.62,100 48.74,99.99 48.86,99.98 48.97,99.97 49.09,99.95 49.32,99.91 49.43,99.88 49.54,99.84 49.65,99.81 49.75,99.77 49.86,99.72 49.96,99.68 50.07,99.63 50.16,99.58 50.26,99.52 50.36,99.46 50.55,99.34 50.64,99.27 50.81,99.13 50.89,99.05 51.05,98.89 51.13,98.81 51.2,98.72 51.27,98.64 51.34,98.55 51.4,98.45 51.46,98.36 51.52,98.26 51.58,98.17 51.63,98.07 51.68,97.96 51.72,97.86 51.77,97.75 51.81,97.65 51.84,97.54 51.88,97.43 51.9,97.32 51.93,97.2 51.95,97.09 51.97,96.97 51.99,96.74 52,96.62 52,3.37
Copper layers (1*16): Top 0.035mm / dielectric 1.5mm / Bottom 0.035mm
Design rules "pighixxx_CAM_DRC_V1.5": minimum track width 6mil, minimum drill 10mil, track to track 6mil, track to pad 6mil, pad to pad 6mil, via to via 6mil, smd to smd 0mil, copper to edge 10mil, drill to drill 10mil, minimum pad ring 10mil, minimum via ring 6mil, stop-mask expansion 2mil, vias tented up to drill 100mil, thermal gap 10mil
Holes 3.2 mm at 4.57,84.15 47.5,84.15 18.42,11.38 33.53,11.38

### Footprints (pad centres in the part's own frame; a part is rotated, then mirrored left to right if it is on the bottom)
JST-3-PTH-VERT = drill 0.7 pad 1.6: 1 -2,-0.55; 2 0,-0.55; 3 2,-0.55
0603-CAP = smd 1.1 x 1: 1 -0.85,0; 2 0.85,0
1210 = smd 1.2 x 2: 1 -1.6,0; 2 1.6,0
PANASONIC_D = smd 3 x 1.4: + 2.4,0; - -2.4,0
JST-4-PTH-VERT = drill 0.7 pad 1.6: 1 -3,-0.55; 2 -1,-0.55; 3 1,-0.55; 4 3,-0.55
FIDUCIAL-1X2 = smd 1 x 1: 1 0,0
SO24W = smd 0.6 x 2.2: 1 -6.985,-4.6; 2 -5.715,-4.6; 3 -4.445,-4.6; 4 -3.175,-4.6; 5 -1.905,-4.6; 6 -0.635,-4.6; 7 0.635,-4.6; 8 1.905,-4.6; 9 3.175,-4.6; 10 4.445,-4.6; 11 5.715,-4.6; 12 6.985,-4.6; 13 6.985,4.6; 14 5.715,4.6; 15 4.445,4.6; 16 3.175,4.6; 17 1.905,4.6; 18 0.635,4.6; 19 -0.635,4.6; 20 -1.905,4.6; 21 -3.175,4.6; 22 -4.445,4.6; 23 -5.715,4.6; 24 -6.985,4.6
2X3 = drill 1.016 pad 1.88 octagon: 1 0,0; 2 0,2.54; 3 2.54,0; 4 2.54,2.54; 5 5.08,0; 6 5.08,2.54
JST-2-PTH-VERT = drill 0.7 pad 1.6: 1 -1,-0.55; 2 1,-0.55
SJ_2S-TRACE = smd 0.635 x 1.27: 1 -0.508,0; 2 0.508,0
KLDVX-0202-B = drill 0.8 pad 1.4 long: 1 -4.9,0.8; 1@1 -4.9,-0.8 | drill 0.8 pad 1.3 long: 2 -2.2,-5.6; 2@1 -0.6,-5.6; 3 0.6,-2.8; 3@1 2.2,-2.8
1X02 = drill 1.016 pad 1.88: 1 0,0; 2 2.54,0
SUPER-SOT3 = smd 1 x 1.4: 1 -0.95,-1.1; 2 0.95,-1.1; 3 0,1.1
0603-RES = smd 1.1 x 1: 1 -0.85,0; 2 0.85,0
0402-RES = smd 0.7 x 0.9: 1 -0.65,0; 2 0.65,0
TRIMPOT-3MM-2 = smd 1.092 x 1.6: 1 -1.155,-1.421; 3 1.155,-1.421 | smd 1.6 x 1.6: 2 0,1.421
0805 = smd 0.8 x 1.2: 1 -0.9,0; 2 0.9,0
TACTILE_SWITCH_SMD = smd 1.524 x 0.762: 1 -2.54,1.905; 2 2.54,1.905; 3 -2.54,-1.905; 4 2.54,-1.905
SOT23 = smd 1 x 1.4: 1 -0.95,-1.1; 2 0.95,-1.1; 3 0,1.1
PAD.03X.05 = smd 1.27 x 1.27: P$1 0,0
TP_15TH = drill 0.381 pad 0.61: P$1 0,0
SOP-8 = smd 0.3 x 1.25: 1 -1.905,-2.585; 2 -0.635,-2.603; 3 0.635,-2.603; 4 1.905,-2.594; 5 1.905,2.596; 6 0.635,2.613; 7 -0.635,2.613; 8 -1.905,2.604 | smd 2.5 x 2.5: EP 0,0
QFN50P500X500X100-29N = smd 0.711 x 0.305: 1 -2.464,1.499; 2 -2.464,0.991; 3 -2.464,0.508; 4 -2.464,0; 5 -2.464,-0.508; 6 -2.464,-0.991; 7 -2.464,-1.499; 15 2.464,-1.499; 16 2.464,-0.991; 17 2.464,-0.508; 18 2.464,0; 19 2.464,0.508; 20 2.464,0.991; 21 2.464,1.499 | smd 0.305 x 0.711: 8 -1.499,-2.464; 9 -0.991,-2.464; 10 -0.508,-2.464; 11 0,-2.464; 12 0.508,-2.464; 13 0.991,-2.464; 14 1.499,-2.464; 22 1.499,2.464; 23 0.991,2.464; 24 0.508,2.464; 25 0,2.464; 26 -0.508,2.464; 27 -0.991,2.464; 28 -1.499,2.464 | smd 3.353 x 3.353: 29 0,0
TQFP44 = smd 1.5 x 0.5: 1 -5.8,4; 2 -5.8,3.2; 3 -5.8,2.4; 4 -5.8,1.6; 5 -5.8,0.8; 6 -5.8,0; 7 -5.8,-0.8; 8 -5.8,-1.6; 9 -5.8,-2.4; 10 -5.8,-3.2; 11 -5.8,-4; 23 5.8,-4; 24 5.8,-3.2; 25 5.8,-2.4; 26 5.8,-1.6; 27 5.8,-0.8; 28 5.8,0; 29 5.8,0.8; 30 5.8,1.6; 31 5.8,2.4; 32 5.8,3.2; 33 5.8,4 | smd 0.5 x 1.5: 12 -4,-5.8; 13 -3.2,-5.8; 14 -2.4,-5.8; 15 -1.6,-5.8; 16 -0.8,-5.8; 17 0,-5.8; 18 0.8,-5.8; 19 1.6,-5.8; 20 2.4,-5.8; 21 3.2,-5.8; 22 4,-5.8; 34 4,5.8; 35 3.2,5.8; 36 2.4,5.8; 37 1.6,5.8; 38 0.8,5.8; 39 0,5.8; 40 -0.8,5.8; 41 -1.6,5.8; 42 -2.4,5.8; 43 -3.2,5.8; 44 -4,5.8
TO228P972X240-3N = smd 0.94 x 1.702: 1 -2.261,-6.096; 3 2.261,-6.096 | smd 6.604 x 7.315: 2 0,0.152
USB-B-PTH-VERTICAL = drill 0.914 pad 1.676: D+ 4.826,4.394; D- 4.826,7.595; GND 7.315,4.394; VBUS 7.315,7.595 | drill 2.286: P$1 0,4.902; P$2 12.04,4.902
USB-A-S = smd 3 x 0.9: D+ 3.45,-1; D- 3.45,1; GND 3.45,-3; VBUS 3.45,3 | drill 2.311: P$5 0,-6.566; P$6 0,6.566
CRYSTAL-SMD-5X3 = smd 1.9 x 1.1: 1 -1.85,-1.15; 2 1.85,-1.15; 3 1.85,1.15; 4 -1.85,1.15

### Placement (x,y rotation side)
BTN  25.66,2.62 0 top
C1  44.32,33.35 90 top
C2  48.26,24.08 0 top
C3  47.12,19.25 90 top
C4  38.97,19.33 270 top
C5  48.26,26.11 0 top
C6  48.26,28.14 0 top
C7  48.26,30.18 0 top
C8  43.56,23.06 270 top
C9  45.09,23.06 270 top
C10  37.72,30.18 0 top
C11  35.18,33.22 90 top
C12  43.05,16.21 180 top
C13  44.2,94.06 180 top
C14  48.26,34.24 180 top
C15  25.02,39.19 270 top
C16  38.23,53.49 0 top
C17  38.25,45.52 0 top
C18  27.56,58.12 90 top
C19  38.25,51.89 180 top
C20  17.02,45.04 0 top
C21  17.15,53.93 180 top
C22  18.8,34.88 0 top
C23  18.8,17.98 0 top
C24  30.23,34.88 0 top
C25  29.72,11.38 270 top
C26  30.23,17.98 0 top
C27  22.86,71.83 270 top
C28  15.62,80.47 90 top
C29  25.4,87.71 90 top
C30  22.99,87.58 90 top
CAM  44.07,97.36 180 top
FID1  50.29,96.85 0 top
FID2  2.03,2.24 0 top
FID3  50.04,2.62 0 top
FID4  1.53,97.23 0 top
IC1  27.31,79.96 0 top
ICSP  25.15,62.05 0 top
L1  18.92,97.36 180 top
L2  12.45,97.36 180 top
L3  5.97,97.36 180 top
LDR  35.69,97.36 180 top
LOGO2  48.9,75.26 0 top
MOT  27.31,97.36 180 top
MS1  39.37,85.55 180 top
MS2  39.37,82.5 180 top
MS3  39.37,79.45 180 top
MS4  39.37,76.4 180 top
MS5  39.37,73.48 180 top
PWR  7.24,9.86 0 top
PWRON  5.97,16.84 0 top
Q1  21.85,7.44 0 top
Q2  19.05,92.15 0 top
Q3  12.57,92.15 0 top
Q4  5.97,92.28 0 top
R1  41.02,23.06 90 top
R2  41.66,33.35 270 top
R3  37.72,26.11 0 top
R4  37.72,28.14 0 top
R6  37.72,34.24 0 top
R7  37.72,32.21 0 top
R9  35.18,27.13 90 top
R11  35.18,30.18 270 top
R13  47.88,53.42 180 top
R14  20.45,63.32 90 top
R15  47.88,52.02 180 top
R18  31.5,1.98 270 top
R19  19.94,1.98 270 top
R20  25.78,11.38 90 top
R21  21.85,11.38 90 top
R22  16.51,70.82 0 top
R23  19.56,71.83 270 top
R24  32.51,68.91 180 top
R25  27.31,39.19 270 top
R26  42.55,73.48 0 top
R27  42.55,76.4 0 top
R28  42.55,85.55 0 top
R29  42.55,82.5 0 top
R30  42.55,79.45 180 top
R31  31.75,71.58 270 top
R32  21.59,71.83 90 top
R33  33.02,71.58 270 top
R34  29.21,71.58 90 top
R35  29.21,87.71 270 top
R36  20.32,87.58 90 top
R37  21.59,87.58 270 top
R38  18.92,87.58 270 top
R39  16.64,90.25 270 top
R40  15.37,90.25 90 top
R41  34.06,94.08 0 top
R42  10.16,90.25 270 top
R43  3.56,90.37 270 top
R44  8.89,90.25 90 top
R45  2.16,90.37 90 top
S1  16.51,63.32 90 top
T1  25.91,7.44 180 top
T2  29.72,7.44 0 top
TP1  50.04,36.91 0 top
TP2  48.39,36.91 0 top
TP3  46.74,36.91 0 top
TP4  30.23,37.42 0 top
TP5  18.8,37.42 0 top
TP6  50.17,19.25 0 top
TP7  16.51,74.88 0 top
U1  43.05,39.83 0 top
U2  43.05,28.14 180 top
U3  27.56,49.48 270 top
U4  18.67,28.91 0 top
U5  30.1,28.91 0 top
U$1  [SCREW]  49.91,83.52 0 top
U$2  [SCREW]  17.02,7.32 0 top
U$3  [SCREW]  32.26,7.57 0 top
U$4  [S_ATTENTION]  23.62,31.19 0 top
U$5  [S_ATTENTION]  34.04,87.96 0 top
U$6  [SCANIT_LOGO]  3.3,55.2 0 top
U$11  [S_ATTENTION]  11.43,31.19 0 top
U$12  [SCREW]  6.99,83.64 0 top
U$22  [BQ_LOGO_SMALL]  4.73,21.31 0 top
U$23  [PIGHIXXX_LOGO]  4.88,71.2 0 top
USB  37.09,3.51 0 top
USBCAM  42.67,62.31 270 bottom
Y1  43.05,19.38 180 top
Y2  17.15,49.48 270 top

### Tracks (layer width: path | path; a pad name or v marks a point on that pad's centre or on a via)
3.3V  (via drill 0.25, 0.3, 0.61)
  Top 0.178: U2.14 41.56,30.91 41.02,31.45 40.13,31.45 39.37,32.21 R7.2 | U2.20 40.16,27.15 39.75,26.75 v39.75,25.99 | U2.4 45.59,28.22 46.61,28.22 46.69,28.14 C6.1
  Top 0.254: U2.27 44.05,25.25 44.58,24.72 44.58,24.42 C9.1 | U2.14 41.2,30.25 v41.07,30.25 | 44.07,31.7 44.11,31.74 44.11,32.5 C1.1 | 44.07,31.7 43.56,31.19 | 43.56,31.19 U2.10 43.54,30.63 43.54,31.17 43.56,31.19 | 44.07,31.7 44.07,32.21 46.74,32.21 47.42,31.52 47.42,30.19 C7.1
  Top 0.305: R14.2 24.73,64.17 ICSP.2 | 23.48,51.88 v23.5,51.89 | 33.02,89.77 33.02,82.5 v32.13,81.61 | v20.32,89.74 R36.2
  Top 0.356: R22.1 15.36,68.29 15.88,67.77 19.18,67.77 20.45,66.5 R14.2
  Top 0.406: U3.34 35.88,45.48 35.94,45.42 37.3,45.42 C17.1 | U3.44 35.88,53.48 35.94,53.54 35.99,53.49 C16.1 | U3.24 24.36,42.01 25.02,41.35 | 25.02,41.35 30.61,41.35 32.39,39.57 | 25.02,41.35 C15.1 | 36.58,66.75 25.91,66.75 25.15,65.99 ICSP.2 22.99,62.43 v22.99,62.05 | U3.14 23.48,51.88
  Top 0.61: U5.3 32.36,18.25 C26.+ | C9.1 47.25,23.91 C2.1 | C2.1 C5.1 47.63,26.33 47.63,26.37 47.75,26.49 47.75,27.64 47.41,27.98 C6.1 C7.1 | U5.3 34.27,24.72 v35.43,24.72 | v46.86,22.43 47.41,22.98 C2.1 | TP4.P$1 32.39,37.42 | 32.39,37.42 v33.28,36.53 | v30.99,22.81 U5.3 | 32.39,37.42 32.39,39.57 35.94,43.13 35.94,45.42 35.94,53.54 35.94,57.86 33.53,60.28 33.53,64.21 36.07,66.75 36.58,66.75 41.28,66.75 43.44,68.91 43.44,73.44 R26.2 R27.2 44.83,77.84 44.83,81.06 R29.2 R28.2 43.41,85.56 43.41,91.44 42.57,92.28 37.85,92.28 36.69,93.44 | LDR.1 36.69,93.44 | IC1.14 33.02,89.77 36.69,93.44
  Top 0.686: C8.1 C9.1
  Bottom 0.254: v35.43,24.72 38.48,24.72 v39.75,25.99 40.64,25.99 41.02,26.37 41.02,30.2 v41.07,30.25
  Bottom 0.305: v32.13,81.61 22.73,81.61 20.32,84.02 v20.32,89.74
  Bottom 0.406: v23.5,51.89 23.5,61.55 v22.99,62.05
  Bottom 0.61: v35.43,24.72 37.72,22.43 v46.86,22.43 | v30.99,22.81 33.15,24.97 33.15,36.4 arc-90 v33.28,36.53
5V  (via drill 0.3, 0.38)
  Top 0.254: C24.1 28.63,37.92 29.52,38.81 v31.5,38.81 | C24.1 | v39.5,38.81 39.5,43.26 40.51,44.27 41.78,44.27 42.42,43.64 U1.7
  Top 0.406: v13.59,48.46 13.59,45.92 16.26,43.26 16.26,39.07 17.91,37.42 TP5.P$1
  Top 0.61: C23.+ 20.93,18.25 U4.3 27.31,22.81 | 27.31,22.81 U5.1 | C24.1 26.8,34.88 25.4,33.48 | 25.4,33.48 25.27,33.35 25.27,24.84 27.31,22.81 | TP5.P$1 21.46,37.42 25.4,33.48
  Bottom 0.254: v31.5,38.81 v39.5,38.81
  Bottom 0.406: L2.1 13.45,96.96 12.7,96.22 | 12.7,96.22 7.62,96.22 6.99,96.85 6.99,97.89 L3.1 | 12.7,96.22 12.7,49.35 v13.59,48.46
AREF  (via drill 0.3)
  Top 0.406: U3.42 34.99,51.88 v35,51.87 | v40.72,51.87 39.13,51.87 C19.1
  Bottom 0.406: v35,51.87 v40.72,51.87
DIR  (via drill 0.3)
  Top 0.305: v26.77,42.39 v26.76,42.41 U3.27 26.8,43.72 26.8,46.31 26.54,46.56 v26.54,49.99 | R33.2 33.19,70.56 v34.16,70.56
  Top 0.406: v26.77,37.36 26.77,37.81 R25.2
  Bottom 0.305: v26.77,42.39 v26.77,37.36 | v34.16,70.56 32.64,69.04 32.64,61.04 30.74,59.13 28.45,59.13 26.54,57.23 v26.54,49.99
ENABLE  (via drill 0.3)
  Top 0.356: MS3.2 v37.21,79.45 | IC1.15 31.75,90.25 v32.26,90.76
  Bottom 0.356: v37.21,79.45 37.21,85.93 35.82,87.33 32.77,87.33 32.26,87.83 v32.26,90.76
GND  (via drill 0.25, 0.3, 0.41, 0.51)
  Top 0.178: 44.05,29.14 v43.44,28.53
  Top 0.254: R4.1 36.2,28.82 v36.2,29.16 | v38.61,31.19 38.57,31.15 C10.2 | R9.1 35.58,26.28
  Top 0.279: U2.6 44.05,29.14
  Top 0.305: C25.2 29.76,10.49 v30.61,10.49 | v31.62,6.17 30.84,6.17 T2.2
  Top 0.61: 35.58,26.28 35.88,26.28 v35.99,26.16 36.82,26.16 R3.1 | C8.2 45.56,22.21 46.23,21.54
  Bottom 0.254: v36.2,29.16 38.23,31.19 v38.61,31.19
  Bottom 0.305: v30.61,10.49 30.61,7.19 v31.62,6.17
  other vias: 21.72,1.86 20.07,4.27 25.66,4.78 42.67,28.53 43.44,27.76 42.67,27.76 39.24,23.32 38.99,21.29 47.12,17.22 43.44,13.16 42.42,13.67 41.4,13.67 40.39,14.05 40.13,19.38 37.47,90.76 38.23,90.76 38.23,89.99 37.47,89.99 38.99,90.76 38.99,89.99 38.99,89.23 38.23,89.23 37.47,89.23 46.46,29.16 34.77,23.06 42.55,5.79 43.31,5.79 44.07,5.79 42.55,5.03 43.31,5.03 44.07,5.03 44.07,4.27 43.31,4.27 42.55,4.27 38.23,50.5 38.23,49.73 38.23,48.97 38.99,48.97 38.99,49.73 38.99,50.5 39.75,50.5 39.75,49.73 39.75,48.97 37.09,55.58 37.09,54.81 37.85,54.81 37.85,55.58 34.8,55.58 34.8,54.81 34.04,54.81 34.04,55.58 26.16,70.05 26.93,70.05 25.4,70.05 25.4,69.29 26.16,69.29 26.93,69.29 26.93,68.53 26.16,68.53 25.4,68.53 35.43,70.05 36.2,70.05 36.96,70.05 36.96,69.29 36.2,69.29 35.43,69.29 35.43,68.53 36.2,68.53 36.96,68.53 46.61,50.5 47.37,50.5 48.13,50.5 48.13,49.73 47.37,49.73 46.61,49.73 46.61,48.97 47.37,48.97 48.13,48.97 48.13,42.37 47.37,42.37 46.61,42.37 46.61,41.61 47.37,41.61 48.13,41.61 47.37,40.84 46.61,40.84 48.13,40.84 15.75,4.27 14.99,4.27 14.23,4.27 14.23,5.03 14.23,5.79 14.99,5.79 15.75,5.79 15.75,5.03 14.99,5.03 5.97,40.84 6.73,40.84 7.49,40.84 7.49,40.08 6.73,40.08 5.97,40.08 5.97,39.32 6.73,39.32 7.49,39.32 7.49,48.97 6.73,48.97 5.97,48.97 5.97,49.73 6.73,49.73 7.49,49.73 7.49,50.5 6.73,50.5 5.97,50.5 5.97,76.91 6.73,76.91 7.49,76.91 7.49,76.15 6.73,76.15 5.97,76.15 5.97,75.39 6.73,75.39 7.49,75.39 6.1,63.58 6.86,63.58 7.62,63.58 7.62,64.34 6.86,64.34 6.1,64.34 6.1,65.1 6.86,65.1 7.62,65.1 46.48,89.23 47.25,89.23 48.01,89.23 48.01,89.99 47.25,89.99 46.48,89.99 46.48,90.76 47.25,90.76 48.01,90.76 44.45,68.28 44.45,67.51 44.45,66.75 44.45,65.99 44.45,65.23 41.91,84.53 41.91,83.77 26.93,80.34 27.69,80.34 28.45,80.34 29.21,80.34 29.97,80.34 30.74,80.34 26.93,79.58 27.69,79.58 28.45,79.58 29.21,79.58 29.97,79.58 30.74,79.58 30.74,78.82 29.97,78.82 29.21,78.82 28.45,78.82 27.69,78.82 26.93,78.82 31.5,80.34 31.5,79.58 31.5,78.82 32.26,80.34 32.26,79.58 32.26,78.82 33.02,80.34 33.02,79.58 33.02,78.82 33.78,80.34 33.78,79.58 33.78,78.82 34.55,78.82 34.55,79.58 34.55,80.34 24.26,78.82 23.5,78.82 22.73,78.82 21.97,78.82 21.21,78.82 20.45,78.82 21.97,78.06 21.21,78.06 20.45,78.06 20.45,81.36 20.45,82.12 21.21,81.36 34.55,81.1 33.78,81.1 19.69,82.12 19.69,81.36 19.69,78.82 19.69,78.06 29.59,51.51 30.23,51 30.86,50.5 28.96,48.72 28.32,49.35 27.69,49.99 34.9,49.56 18.42,40.84 19.18,40.84 19.94,40.84 19.94,40.08 19.18,40.08 18.42,40.08 18.42,39.32 19.18,39.32 19.94,39.32 16,32.08 17.02,32.08 18.04,32.08 19.31,32.08 20.32,32.08 21.34,32.08 31.75,32.08 30.74,32.08 29.47,32.08 28.45,32.08 27.43,32.08 16,31.07 17.02,31.07 18.04,31.07 19.31,31.07 20.32,31.07 21.34,31.07 27.43,31.07 28.45,31.07 29.47,31.07 30.74,31.07 31.75,31.07 16,26.11 27.43,26.11 17.02,26.11 18.04,26.11 28.45,26.11 29.47,26.11 30.74,26.11 31.75,26.11 21.34,26.11 20.32,26.11 19.31,26.11 16,27.13 17.02,27.13 18.04,27.13 19.31,27.13 20.32,27.13 21.34,27.13 27.43,27.13 28.45,27.13 29.47,27.13 30.74,27.13 31.75,27.13 18.04,29.67 19.31,29.67 19.31,28.27 18.04,28.27 29.47,29.67 30.74,29.67 30.74,28.27 29.47,28.27
  pour Bottom: -1.27,100.66 -1.27,-0.43 53.34,-0.43 53.34,100.66
  pour Top: -1.4,100.53 -1.4,-0.56 53.47,-0.56 53.47,100.41
LAS1_OUT  (via drill 0.3)
  Top 0.254: R42.2 10.16,88.47 9.65,87.96 3.43,87.96 1.14,85.68 1.14,50.88 v1.14,49.99 | U3.28 27.56,47.07 v28.2,47.7
  Bottom 0.254: v28.2,47.7 8.26,47.7 8,47.7 2.92,47.7 1.14,49.48 v1.14,49.99
LAS2_OUT  (via drill 0.3)
  Top 0.254: 3.56,88.98 0.51,85.93 0.51,48.59 v0.76,48.34 | U3.29 28.36,46.72 v28.7,47.07
  Top 0.305: 3.56,88.98 R43.2
  Bottom 0.254: v28.7,47.07 2.03,47.07 v0.76,48.34
LDRIN  (via drill 0.3)
  Top 0.305: LDR.2 34.69,94.31 R41.2 34.91,93.15 v34.29,92.53 | v40.39,54.05 42.29,52.15 42.29,47.7 41.66,47.07 v36.96,47.07 | v34.93,47.07 33.37,47.07 U3.36
  Bottom 0.305: v34.29,92.53 34.29,89.74 37.85,86.18 37.85,65.23 38.48,64.59 38.48,55.96 v40.39,54.05 | v36.96,47.07 v34.93,47.07
LED_OUT  (via drill 0.3)
  Top 0.254: R39.2 16.64,87.96 16,87.33 3.81,87.33 1.78,85.29 1.78,50.88 1.78,48.08 v3.43,46.43 | U3.30 29.16,46.38 v29.21,46.43
  Bottom 0.254: v29.21,46.43 7.62,46.43 7.37,46.43 v3.43,46.43
LINK  (via drill 0.25)
  Top 0.178: v39.5,33.61 39.5,33.99 39.24,34.24 R6.2 | U2.16 39.9,29.14 39.5,29.54 v39.5,31.07
  Bottom 0.178: v39.5,31.07 v39.5,33.61
M_DN1  (via drill 0.25, 0.3)
  Top 0.254: U2.28 44.63,25.6 v46.1,25.6
  Top 0.356: v39.63,62.43 v43.69,62.43
  Bottom 0.254: USBCAM.D+ 43.69,58.84 43.69,56.21 44.83,55.07 49.79,55.07 51.44,53.42 51.44,26.37 50.67,25.6 v46.1,25.6
  Bottom 0.356: CAM.4 41.07,63.88 v39.63,62.43 | v43.69,62.43 43.69,58.87 USBCAM.D+
M_DN2  (via drill 0.25, 0.3)
  Top 0.178: 45.54,27.13 45.62,27.05 v46.69,27.05
  Top 0.254: U2.2 45.54,27.13 | TP1.P$1 50.04,51.91 R13.1
  Bottom 0.254: v46.69,27.05 47.45,27.05 47.88,26.62 50.04,26.62 50.42,27 50.42,36.53 TP1.P$1
  other vias: 50.04,36.91
M_UP
  Top 0.178: U2.21 40.59,25.55 40.39,25.35 39.37,25.35 37.97,23.95 36.7,23.95
  Top 0.381: USB.D- 41.89,11.13 39.88,11.13 35.82,15.19 35.82,23.06 36.7,23.95
MISO
  Top 0.305: U3.11 23.56,60.47 ICSP.1
MOSI
  Top 0.305: U3.10 24.36,58.98 26.42,61.04 26.42,63.32 ICSP.4
MS1
  Top 0.356: MS4.2 37.34,76.4 36.3,75.36 IC1.12
MS2
  Top 0.356: IC1.13 36.22,84.56 37.21,85.55 MS1.2
N$1  (via drill 0.25)
  Top 0.254: R4.2 37.55,27.13 v37.09,27.13 | v40.13,30.43 40.13,30.1 U2.15
  Bottom 0.254: v37.09,27.13 39.75,27.13 40.26,27.64 40.26,30.3 v40.13,30.43
N$2
  Top 0.178: C10.1 36.87,29.12 37.09,28.91 39.63,28.91 39.88,28.65 U2.17
  Top 0.61: C10.1 R7.1
N$7  (via drill 0.25)
  Top 0.178: U2.18 v39.63,28.14 | v34.39,27.97 35.17,27.97 R9.2
  Top 0.61: R9.2 R11.2
  Bottom 0.178: v39.63,28.14 34.57,28.14 v34.39,27.97
N$8  (via drill 0.25)
  Top 0.254: C12.1 42.63,14.94 v39.24,14.94 | v34.16,30.43 34.76,31.03 R11.1
  Top 0.305: USB.VBUS 44.4,15.71 C12.1
  Top 0.61: C11.1 R11.1
  Bottom 0.254: v39.24,14.94 33.78,20.4 33.78,29.16 34.16,29.54 v34.16,30.43
N$9
  Top 0.305: C20.2 18.04,45.04 18.16,45.16 18.16,47.5 Y2.3 18.3,49.11 18.67,49.48 U3.17
N$10
  Top 0.305: C21.2 16.26,53.93 16,53.67 Y2.1 16,50.63 16.64,49.99 19.94,49.99 20.19,50.24 21.72,50.24 U3.16
N$11  (via drill 0.3)
  Top 0.254: R15.2 46.34,52.91 42.42,52.91 38.1,57.23 v37.47,57.23 | v29.16,57.48 U3.4 | U3.4
  Bottom 0.254: v37.47,57.23 37.47,58.24 37.09,58.62 30.3,58.62 v29.16,57.48
N$12  (via drill 0.3)
  Top 0.254: R13.2 42.55,53.42 38.1,57.86 v36.83,57.86 | v29.97,57.1 29.97,55.29 U3.3
  Bottom 0.254: v36.83,57.86 30.74,57.86 v29.97,57.1
N$13
  Top 0.61: BTN.1 23.66,4.09 T1.3
N$14
  Top 0.508: IC1.8 R34.2
N$15
  Top 0.508: R35.2 IC1.17
N$16
  Top 0.508: IC1.2 R32.2 C27.1
N$17
  Top 0.508: IC1.23 R37.2 C30.1
N$18
  Top 0.356: R22.3 18.9,69.4 19.56,70.05 R23.2
N$19
  Top 0.508: IC1.10 R31.1
N$20
  Top 0.508: IC1.11 R33.1
N$21
  Top 0.356: MS5.1 R26.1
N$23
  Top 0.356: MS4.1 R27.1
N$24
  Top 0.356: MS1.1 R28.1
N$25
  Top 0.356: MS2.1 R29.1
N$26
  Top 0.356: MS3.1 R30.2
N$27
  Top 0.508: Q2.1 18.06,91.1 17.15,91.1 R39.1 R40.2
N$28
  Top 0.508: L1.2 17.92,94.38 Q2.3
N$29
  Top 0.508: Q3.1 11.58,91.1 R42.1 R44.2
N$30
  Top 0.508: L2.2 11.45,94.38 Q3.3
N$31
  Top 0.508: Q4.1 4.98,91.22 R43.1 R45.2
N$32
  Top 0.508: L3.2 4.97,94.38 Q4.3
N$42  (via drill 0.61)
  Top 0.61: R19.2 19.01,1.13 18.54,1.6 18.54,3.99 Q1.1 20.68,6.55 v19.56,6.55 | R18.1 v31.5,3.89
  Bottom 0.61: v31.5,3.89 22.23,3.89 v19.56,6.55
N$43
  Top 0.61: R18.2 28.59,1.13 BTN.3
N$45
  Top 0.61: BTN.2 25.66,3.23 T2.1
N$46
  Top 0.508: 26,10.53 26.8,9.73 26.8,8.6
  Top 0.61: R20.1 26,10.53 | 26.8,8.6 T1.1
NON_R1
  Top 0.254: U2.13 42.06,31.29 41.66,31.7 R2.2
OCS_N1  (via drill 0.25, 0.3)
  Top 0.254: U2.8 45.14,31.19 v45.72,31.19 | U1.2 v42.42,36.27
  Bottom 0.254: v45.72,31.19 45.72,34.49 43.94,36.27 v42.42,36.27
OCS_N2
  Top 0.178: U2.12 42.55,34.75 43.69,35.89 U1.3
OUT1A
  Top 0.356: 26.29,97.89 MOT.3
  Top 0.508: IC1.16 30.48,90.25 26.29,94.44 26.29,97.89
OUT1B
  Top 0.508: IC1.21 24.13,97.73 MOT.4
OUT2A  (via drill 0.41)
  Top 0.508: v30.48,73.36 IC1.9
  Bottom 0.508: v30.48,73.36 34.42,73.36 35.56,74.5 35.56,85.04 34.93,85.68 31.52,85.68 30.33,86.87 30.33,97.89 MOT.1
OUT2B  (via drill 0.38, 0.41)
  Top 0.508: IC1.4 v24.13,73.36 | v31.62,93.55 28.96,93.55 28.32,94.18 28.32,97.89 MOT.2
  Bottom 0.508: v24.13,73.36 29.08,73.36 30.1,72.34 34.8,72.34 36.4,73.94 36.4,85.6 35.43,86.56 32.13,86.56 31.24,87.45 31.24,93.17 v31.62,93.55
P_DN1  (via drill 0.25)
  Top 0.254: U2.1 45.8,26.37 v46.31,26.37
  Bottom 0.254: USBCAM.D- 41.67,57.85 41.66,57.83 41.66,56.21 43.31,54.56 49.53,54.56 50.93,53.16 50.93,26.62 50.42,26.11 46.56,26.11 v46.31,26.37
  Bottom 0.356: CAM.3 43.07,63.97 41.66,62.56 41.66,58.87 USBCAM.D-
P_DN2  (via drill 0.25, 0.3)
  Top 0.254: U2.3 v46.18,27.64 | TP2.P$1 48.39,37.42 49.53,38.56 49.53,51.64 49.15,52.02 R15.1
  Bottom 0.254: v46.18,27.64 47.63,27.64 48.13,27.13 49.79,27.13 49.91,27.26 49.91,35.38 TP2.P$1
  other vias: 48.39,36.91
P_UP
  Top 0.178: U2.22 41.56,25.12 41.4,24.97 39.5,24.97 38.1,23.57 37.09,23.57 36.7,23.19 36.7,23.06
  Top 0.381: USB.D+ 43.18,9.17 43.18,11.63 42.17,12.65 39.75,12.65 36.7,15.7 36.7,23.06
PFD
  Top 0.508: IC1.24 R36.1 R38.2
PPWR1  (via drill 0.25, 0.3)
  Top 0.254: U2.7 45.85,29.97 v45.85,30.18 | v41.15,36.02 U1.1
  Bottom 0.254: v45.85,30.18 46.36,30.68 46.36,34.75 44.07,37.03 42.17,37.03 v41.15,36.02
PPWR2
  Top 0.178: U2.11 43.05,34.49 44.96,36.4 U1.4
PWR1  (via drill 0.3)
  Top 0.305: v50.29,52.66 51.31,53.67 v51.31,54.56 | v41.15,43.38 U1.8 | C13.1 47.07,96.08 CAM.1
  Bottom 0.305: USBCAM.GND 45.67,56.39 46.48,55.58 50.04,55.58 51.06,54.56 v51.31,54.56 | v41.15,43.38 49.79,43.38 50.42,44.02 50.42,52.53 v50.29,52.66
  Bottom 0.356: USBCAM.GND 45.59,58.94 45.59,81.23 43.69,83.14 43.69,94.18 45.04,94.18 47.07,96.22 CAM.1
PWR2  (via drill 0.3)
  Top 0.254: U1.5 44.96,40.97 | 44.96,40.97 44.96,40.34 46.74,38.56 TP3.P$1 46.74,35.89 47.25,35.38 48.64,35.38 49.11,34.91 C14.1 | U3.7 26.76,53.71 v27.18,53.29 | v44.96,51.84 44.96,40.97
  Bottom 0.254: v27.18,53.29 43.51,53.29 v44.96,51.84
RBIAS  (via drill 0.25)
  Top 0.178: U2.26 43.56,25.1 v43.41,24.92 | v39.75,24.41 39.75,24.08 39.88,23.95 40.98,23.95 R1.2
  Bottom 0.178: v43.41,24.92 40.21,24.92 v39.75,24.41
RESET  (via drill 0.3)
  Top 0.356: IC1.22 22.86,83.26 v23.62,82.5 | MS2.2 v33.91,82.5
  Bottom 0.356: v33.91,82.5 v23.62,82.5
RST  (via drill 0.3)
  Top 0.305: v21.97,62.43 20.49,62.43 R14.1 20.45,61.42 19.81,60.78 | S1.3 19.81,60.78 | U3.13 20.3,52.68 19.81,53.16 19.81,60.78
  Bottom 0.305: ICSP.5 30.23,62.31 29.21,63.32 22.86,63.32 v21.97,62.43
SCK
  Top 0.305: U3.9 25.16,58.76 27.69,61.29 ICSP.3
SLEEP  (via drill 0.3)
  Top 0.356: MS5.2 v37.21,73.48 | v37.21,77.29 36.83,77.67 v34.16,77.67 | IC1.3 22.86,76.91 v23.62,77.67
  Bottom 0.356: v37.21,73.48 v37.21,77.29 | v34.16,77.67 v23.62,77.67
SLS1  (via drill 0.3)
  Top 0.305: 25.93,43.65 U3.26 25.93,43.71 v25.93,45.24 | v28.58,8.59 29.68,8.59 T2.3
  Bottom 0.305: v28.58,8.59 27.94,8.59 25.4,11.13 25.4,44.71 v25.93,45.24
SLS2  (via drill 0.3)
  Top 0.305: 25.15,43.67 U3.25 25.15,43.69 v25.15,45.54 | v24.77,13.29 24.77,13.25 R20.2
  Top 0.508: C25.1 R20.2 R21.2
  Bottom 0.305: v24.77,13.29 24.77,45.16 v25.15,45.54
STEP  (via drill 0.3)
  Top 0.305: R24.2 31.75,68.82 v31.75,67.77 | v25.27,50.88 27.94,50.88 29.97,48.85 29.97,43.69 U3.31
  Top 0.508: R31.2 31.66,70.64 R24.2
  Bottom 0.305: v31.75,67.77 32.13,67.39 32.13,61.42 30.48,59.77 28.2,59.77 25.91,57.48 25.91,51.51 v25.27,50.88
SUSP
  Top 0.178: U2.19 40.01,27.64 39.37,27 38.86,27 38.48,26.62 38.48,26.2 R3.2
UCAP
  Top 0.406: U3.6 C18.1
VCC  (via drill 0.61)
  Top 0.61: R19.1 21.25,4.14 21.85,4.14 22.8,5.09 Q1.2 23.5,7.04 v23.5,7.57
  Top 0.711: PWR.1 5.97,14.29 PWRON.1
  Bottom 0.61: v23.5,7.57 23.5,12.4 21.59,14.3 7.24,14.3 5.97,15.57 PWRON.1
VIN
  Top 0.508: C29.1 IC1.20
  Top 0.61: Q1.3 21.8,8.59 12.07,8.59 8.51,12.14 PWRON.2 8.51,20.14 11.18,22.81 15.88,22.81 | 15.88,22.81 U4.1 | C22.1 16.64,34.88 | 16.64,34.88 15.5,34.88 13.84,33.22 13.84,24.84 15.88,22.81 | IC1.20 25.4,80.34 | 25.4,80.34 IC1.5 | 25.4,80.34 18.15,80.34 C28.+ 7.6,82.86 2.54,77.8 2.54,48.85 4.83,46.56 11.94,46.56 15.5,43 15.5,36.02 16.64,34.88
VREF
  Top 0.356: R22.2 TP7.P$1 19.84,74.88 IC1.1
XIN
  Top 0.178: 45.25,20.18 Y1.1 43.56,20.52 42.29,21.79 42.29,24.59 42.55,24.84 U2.24 | 45.33,20.1 45.33,20.39 45.47,20.52 45.59,20.52 45.72,20.4 46.83,20.4 C3.2
  Top 0.254: 45.33,20.1 45.25,20.18 Y1.1
XOUT
  Top 0.178: U2.23 42.04,25.66 42.04,24.97 41.91,24.84 41.91,21.67 42.67,20.91 42.67,19.7 Y1.3 39.21,18.23 C4.2

### Text on the board
tNames: HOT! | Polyphemus | HOT! | HOT!